# Altium project Mealy.PrjPcb
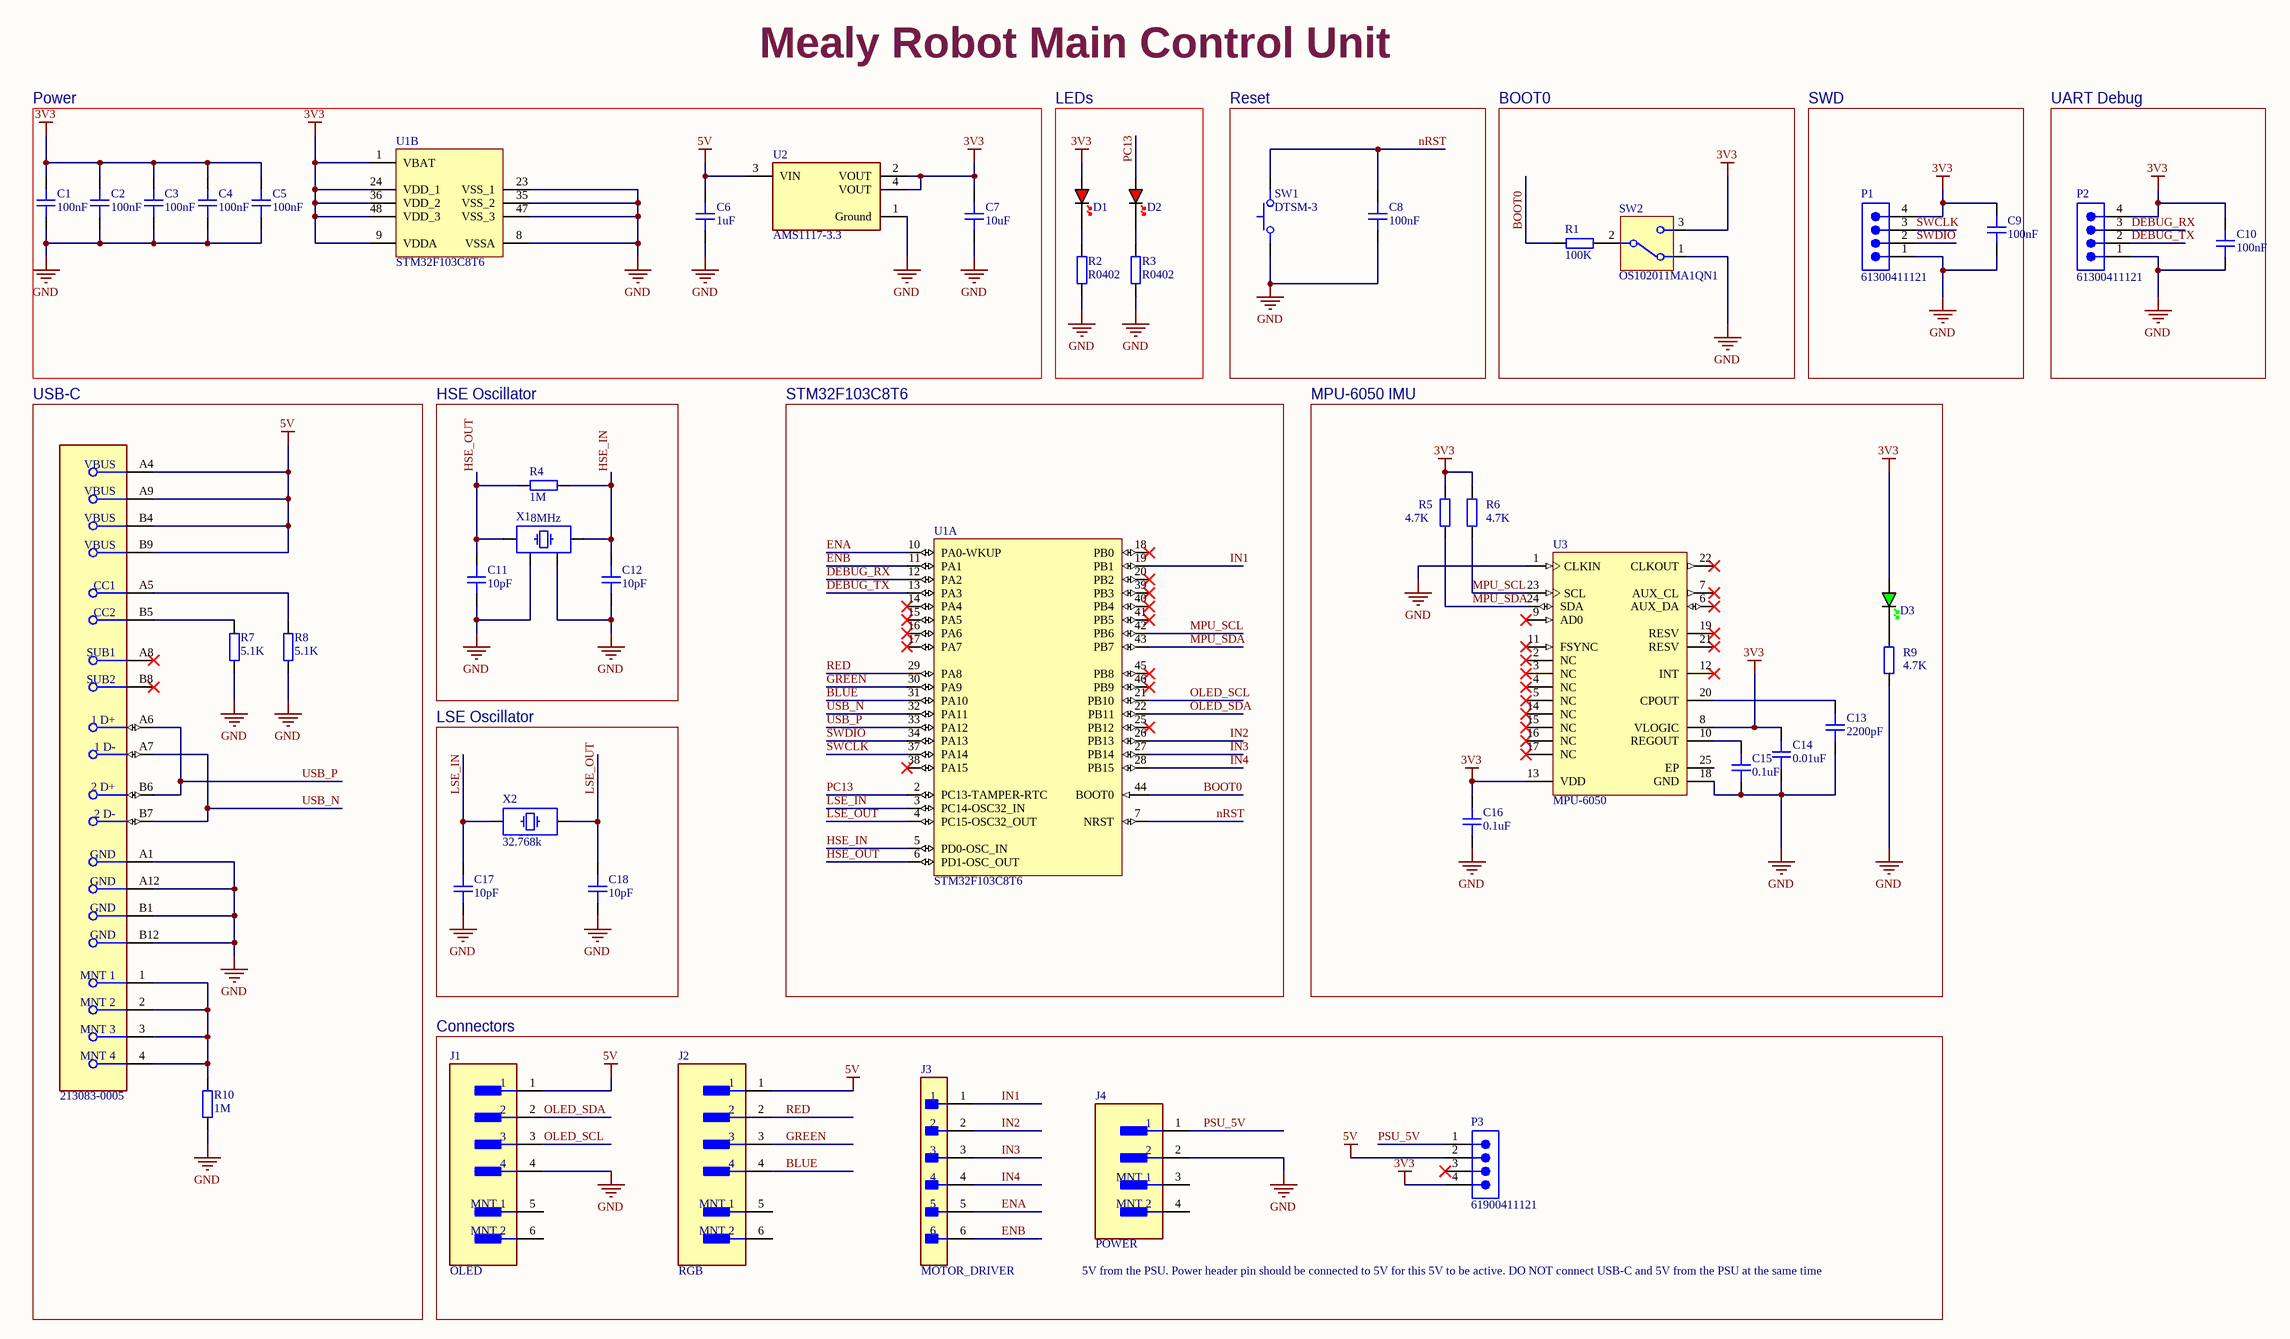
[diagram p0: main.SchDoc]
1 sheet, 46 parts. Net scope: global (net labels, ports and power ports of the same name join across sheets).
Board file: main.PcbDoc

## Sheet main.SchDoc
size C; SheetNumber: 1; SheetTotal: 1

### Parts
C1  100nF  [CAP_0603]
C2  100nF  [CAP_0603]
C3  100nF  [CAP_0603]
C4  100nF  [CAP_0603]
C5  100nF  [CAP_0603]
C6  1uF  [CAP_0603]
C7  10uF  [CAP_0603]
C8  100nF  [CAP_0603]
C9  100nF  [CAP_0603]
C10  100nF  [CAP_0603]
C11  10pF  [CAP_0603]
C12  10pF  [CAP_0603]
C13  2200pF  [CAP_0603]
C14  0.01uF  [CAP_0603]
C15  0.1uF  [CAP_0603]
C16  0.1uF  [CAP_0603]
C17  10pF  [CAP_0603]
C18  10pF  [CAP_0603]
D1  RED  [LED_0603_RED]  (value not drawn)
D2  RED  [LED_0603_RED]  (value not drawn)
D3  GREEN  [LED_0603_GREEN]  (value not drawn)
J1  OLED  [FP-SM04B-ZESS-TB_LF_SN-MFG]
J2  RGB  [FP-SM04B-ZESS-TB_LF_SN-MFG]
J3  MOTOR_DRIVER  [FP-B6P-VH_LF_SN-MFG]
J4  POWER  [FP-BM02B-PASS-1-TFT_LF_S-MFG]
P1  61300411121  [61300411121]
P2  61300411121  [61300411121]
P3  61900411121  [61900411121]
R1  100K  [RES_0603]
R2  R0402  [RES_0402]
R3  R0402  [RES_0402]
R4  1M  [RES_0402]
R5  4.7K  [RES_0603]
R6  4.7K  [RES_0603]
R7  5.1K  [RES_0603]
R8  5.1K  [RES_0603]
R9  4.7K  [RES_0603]
R10  1M  [RES_0603]
SW1  DTSM-3  [DTSM-3]
SW2  OS102011MA1QN1  [OS102011MA1QN1]
U1  STM32F103C8T6  [STM-LQFP48_L]  (parts A,B of 2)
U2  AMS1117-3.3  [FP-AMS1117-IPC_C]
U3  MPU-6050  [IS-QFN-24_V]
X1  8MHz  [XTAL_2520]
X2  32.768k  [XTAL_3215-2]
  213083-0005  [FP-2130830005-MFG]

### Blocks framed on the sheet
Power: C1-C7 U1 U2
LEDs: D1 D2 R2 R3
Reset: C8 SW1
BOOT0: R1 SW2
SWD: C9 P1
UART Debug: C10 P2
USB-C: R7 R8 R10 
HSE Oscillator: C11 C12 R4 X1
STM32F103C8T6: U1
MPU-6050 IMU: C13-C16 D3 R5 R6 R9 U3
LSE Oscillator: C17 C18 X2
Connectors: J1-J4 P3

### Nets
3V3: C1.2 C2.2 C3.2 C4.2 C5.2 C7.2 C9.2 C10.2 C14.2 C16.2 D1.A D3.A P1.4 P2.4 P3.4 R5.2 R6.2 SW2.3 U1.1(VBAT) U1.9(VDDA) U1.24(VDD_1) U1.36(VDD_2) U1.48(VDD_3) U2.2(VOUT) U2.4(VOUT) U3.8(VLOGIC) U3.13(VDD)
5V: C6.2 J1.1 J2.1 P3.2 U2.3(VIN) .A4(VBUS) .A9(VBUS) .B4(VBUS) .B9(VBUS)
GND: C1.1 C2.1 C3.1 C4.1 C5.1 C6.1 C7.1 C8.1 C9.1 C10.1 C11.1 C12.1 C13.1 C14.1 C15.1 C16.1 C17.1 C18.1 J1.4 J4.2 P1.1 P2.1 R2.1 R3.1 R7.1 R8.1 R9.1 R10.1 SW1.1 SW2.1 U1.8(VSSA) U1.23(VSS_1) U1.35(VSS_2) U1.47(VSS_3) U2.1(Ground) U3.1(CLKIN) U3.18(GND) X1.2 X1.4 .A1(GND) .A12(GND) .B1(GND) .B12(GND)
BLUE: J2.4 U1.31(PA10)
BOOT0: R1.1 U1.44(BOOT0)
DEBUG_RX: P2.3 U1.12(PA2)
DEBUG_TX: P2.2 U1.13(PA3)
ENA: J3.5 U1.10(PA0-WKUP)
ENB: J3.6 U1.11(PA1)
GREEN: J2.3 U1.30(PA9)
HSE_IN: C12.2 R4.1 U1.5(PD0-OSC_IN) X1.3
HSE_OUT: C11.2 R4.2 U1.6(PD1-OSC_OUT) X1.1
IN1: J3.1 U1.19(PB1)
IN2: J3.2 U1.26(PB13)
IN3: J3.3 U1.27(PB14)
IN4: J3.4 U1.28(PB15)
LSE_IN: C17.2 U1.3(PC14-OSC32_IN) X2.1
LSE_OUT: C18.2 U1.4(PC15-OSC32_OUT) X2.2
MPU_SCL: R6.1 U1.42(PB6) U3.23(SCL)
MPU_SDA: R5.1 U1.43(PB7) U3.24(SDA)
nRST: C8.2 SW1.2 U1.7(NRST)
OLED_SCL: J1.3 U1.21(PB10)
OLED_SDA: J1.2 U1.22(PB11)
PC13: D2.A U1.2(PC13-TAMPER-RTC)
PSU_5V: J4.1 P3.1
RED: J2.2 U1.29(PA8)
SWCLK: P1.3 U1.37(PA14)
SWDIO: P1.2 U1.34(PA13)
USB_N: U1.32(PA11) .A7(1_D-) .B7(2_D-)
USB_P: U1.33(PA12) .A6(1_D+) .B6(2_D+)
NetC13_2: C13.2 U3.20(CPOUT)
NetC15_2: C15.2 U3.10(REGOUT)
NetD1_K: D1.K R2.2
NetD2_K: D2.K R3.2
NetD3_K: D3.K R9.2
NetR1_2: R1.2 SW2.2(COM)
NetR7_2: R7.2 .B5(CC2)
NetR8_2: R8.2 .A5(CC1)
NetR10_2: R10.2 .1(MNT_1) .2(MNT_2) .3(MNT_3) .4(MNT_4)

Not connected (* = marked no-connect by the designer): J1 5(MNT_1) 6(MNT_2); J2 5(MNT_1) 6(MNT_2); J4 3(MNT_1) 4(MNT_2); P3 3*; U1 14(PA4)* 15(PA5)* 16(PA6)* 17(PA7)* 18(PB0)* 20(PB2)* 25(PB12)* 38(PA15)* 39(PB3)* 40(PB4)* 41(PB5)* 45(PB8)* 46(PB9)*; U3 2(NC)* 3(NC)* 4(NC)* 5(NC)* 6(AUX_DA)* 7(AUX_CL)* 9(AD0)* 11(FSYNC)* 12(INT)* 14(NC)* 15(NC)* 16(NC)* 17(NC)* 19(RESV)* 21(RESV)* 22(CLKOUT)* 25(EP);  A8(SUB1)* B8(SUB2)*

### Notes on the sheet
- Mealy Robot Main Control Unit
- 5V from the PSU. Power header pin should be connected to 5V for this 5V to be active. DO NOT connect USB-C and 5V from the PSU at the same time

### Library data of the parts
C1-C18 = CAP_0603: Capacitor SMD 0603; Manufacturer: *; Manufacturer Part Number: *; Distributor Link: *; LCSC: *; Rating: *; Dielectric: *
D1 D2 = LED_0603_RED: LED 0603 RED SMD
D3 = LED_0603_GREEN: LED 0603 GREEN SMD
J1 J2 = CMP-17439-000309-1: CONN HEADER SMD R/A 4POS 1.5MM; Voltage Rating: 100V; Pitch: 0.059inch; Number of Contacts: 4; Gender: Male; Flammability Rating: UL94 V-0; Contact Finish - Mating: TIN; Insulation Material: Nylon; Series: ZE; Fastening Type: Ramp; Lead Free: Lead Free; Contact Shape: Rectangular; Number of Rows: 1; Packaging: Cut Tape; Mount: Surface Mount; Insulation Color: Natural; Color: Natural; REACH SVHC: No SVHC; Contact Type: Outer Shroud Contact; Number of Positions: 4; Contact Material: Copper Alloy; Max Operating Temperature: 85°C; Min Operating Temperature: -25°C; Contact Plating: Tin; Connector Type: Header; Termination: Solder
J3 = CMP-17439-000380-1: CONN HEADER VERT 6POS 3.96MM; Max Current Rating: 10A; Number of Contacts: 6; Mated Stacking Heights: 16.5mm; Contact Resistance: 20mR; Max Voltage Rating (AC): 250V; Gender: Male; Contact Type: Male Pin; Packaging: Bulk; Insulation Color: Natural; Length: 23.7mm; Orientation: Straight; Color: Natural; Contact Shape: Square; Housing Material: Polyamide; Mount: Through Hole; Max Operating Temperature: 85°C; Pitch: 3.96mm; Number of Positions: 6; Termination: Solder; Height: 8.5mm; Number of Pins: 6; Contact Material: Brass; Current Rating: 10A; Fastening Type: Ramp; Contact Finish - Mating: TIN; Series: VH; Width: 14.6mm; Voltage Rating: 250V; Insulation Material: Nylon; Depth: 8.5mm; Number of Rows: 1; Min Operating Temperature: -25°C; Contact Mating Length: 0.303inch; Lead Free: Lead Free; Flammability Rating: UL94 V-0; Contact Plating: Copper; Housing Color: White; REACH SVHC: No SVHC; Connector Type: Header
J4 = CMP-17439-000073-1: CONN HEADER SMD 2POS 2MM; Number of Positions: 2; Gender: Male; Pitch: 0.079inch; Connector Type: Male Pin; Contact Plating: Tin; Contact Material: Copper; Color: Natural; Packaging: Tape and Reel; Series: PA; Termination: Solder; Mount: Surface Mount; Fastening Type: Ramp; Number of Rows: 1; Lead Free: Lead Free; Number of Contacts: 2; Contact Type: Male Pin
P1 P2 = CMP-1502-01064-2: NexarPartId: 32855522; Pitch: 2.54mm; Number of Contacts: 4; Contact Resistance: 20mΩ; Gender: Male; Current Rating: 3A; Connector Type: Male Pin; Voltage Rating: 250V; Lead Free: Lead Free; Contact Plating: Gold; Max Operating Temperature: 105°C; Packaging: Bulk; Height: 8.89mm; Orientation: Vertical; Contact Mating Length: 5.9944mm; Contact Material: Copper; Lead Pitch: 2.54mm; Min Operating Temperature: -40°C; Termination: Solder; Color: Black; Number of Rows: 1; REACH SVHC: Unknown; RoHS: Compliant; Mount: Through Hole; Number of Positions: 4; Number of Pins: 4; Operating Supply Voltage: 250V
P3 = CMP-1502-00586-2: NexarPartId: 18818226; Connector Type: Male Pin; Insulation: Insulated; Number of Positions: 4; Gender: Male; Operating Supply Voltage: 250V; Pitch: 2.54mm; Current Rating: 3A; Insulation Resistance: 1GΩ; Contact Resistance: 20mΩ; Termination: Through Hole; Contact Material: Copper; Height: 3.3mm; Width: 10.2mm; RoHS: Compliant; REACH SVHC: Unknown; Max Operating Temperature: 105°C; Contact Plating: Tin; Lead Free: Lead Free; Contact Gender: Male; Lead Pitch: 2.54mm; Flammability Rating: UL94 V-0; Packaging: Bulk; Housing Material: Nylon; Number of Pins: 4; Number of Contacts: 4; Color: Beige; Number of Rows: 1; Orientation: Vertical; Contact Mating Length: 7.493mm; Mount: Through Hole; Min Operating Temperature: -40°C; Voltage Rating: 250V; Fastening Type: Friction; Length: 10.16mm
R1 R5-R10 = RES_0603: Resistor SMD 0603; Manufacturer: *; Manufacturer Part Number: *; Distributor Link: *; LCSC: *
R2-R4 = RES_0402: Resistor SMD 0402; Manufacturer: *; Manufacturer Part Number: *; Distributor Link: *; LCSC: *
SW1 = DTSM-3: Tactile Switch SMD SPST; Manufacturer: Diptronics; Manufacturer Part Number: DTSM-3
SW2 = OS102011MA1QN1: Slide Switch SPDT Horizontal THT; Manufacturer: C&K; Manufacturer Part Number: OS102011MA1QN1
U1 = CMP-0237-00215-3: ARM Cortex-M3 32-bit MCU, 64 KB Flash, 20 KB Internal RAM, 37 I/Os, 48-pin LQFP, -40 to 85 degC, Tray; Supply Voltage(Vcc) min (V): 2; Internal RAM Size (kB): 20; FLASH Size (Prog) (kB): 64; A/D Converter: 2x12-bit (10 Channel); I/Os (High Current): 37; Operating Frequency(F) (Processor speed) (MHz): 72; Core: ARM Cortex-M3; ComponentLink3Description: Package Specification; Mounting Technology: Surface Mount; PartNumber: STM32F103C8T6; PackageReference: LQFP48; Packing: Tray; ComponentLink3URL: http://www.st.com/st-web-ui/static/active/en/resource/technical/document/datasheet/DM00058181.pdf; DatasheetVersion: Rev. 16; ComponentLink1URL: http://www.st.com/web/en/home.html; PackageVersion: Rev. 6, 06/2013; ComponentLink2URL: http://www.st.com/st-web-ui/static/active/en/resource/technical/document/datasheet/CD00161566.pdf; ComponentLink1Description: Manufacturer URL; ComponentLink2Description: Datasheet; PackageDescription: 48-Pin Low Profile Quad Flat Package, 7 x 7 mm Body, 0.5 mm Pitch
U2 = CMP-209535-000001-1: LDO Voltage Regulators 1A, 3.3V; Manufacturer: Advanced Monolithic Systems; Dropout Voltage: 1.1V; Output Type: Fixed; Nominal Supply Current: 5mA; Max Power Dissipation: 1.2W; Max Supply Voltage: 15V; Number Of Outputs: 1; Standoff Height: 0.64mm; Max Junction Temp: +125°C; Height: 1.8mm; Package: AMS1117; Device Class L2: Power Management ICs; ComponentLink2Description: Datasheet; ComponentLink2URL: http://www.advanced-monolithic.com/pdf/ds1117.pdf; Category: IC; RoHS: TRUE; Automotive: No; Device Class L1: Integrated Circuits (ICs); Output Current: 1A; Device Class L3: Voltage Regulators - Linear; Temperature: -40°C to +125°C; Output Voltage: 3.3V; Manufacturer Part Number: AMS1117-3.3; Temperature Range Low: -40°C; Octopart: https://octopart.com/ams1117-3.3-advanced+monolithic+systems-25899300; Lead Free: Yes; Ipc Land Pattern Name: SOT229P700X180-4; Temperature Range High: +125°C
U3 = CMP-1753-00002-2: 3-Axis Gyroscope, Accelerometer and a Digital Motion Processor(TM) (DMP), 2.375 to 3.46 V, -40 to 85 degC, 24-Pin QFN, RoHS, Tape and Reel; Manufacturer: InvenSense; Featured Product: MPU-60506-Axis,IntegratedI²CSolution; Other Names: 1428-1007-2 / MPU6050; Sensor Type: MotionTracking; Online Catalog: MPU-6000™Series; Unit PriceUSD: Digital; Datasheet Version: Rev. 3.3, 05/2012; Category: Sensors,Transducers; Datasheet URL: http://datasheet.octopart.com/MPU-6050-InvenSense-datasheet-14421344.pdf; Family: Multifunction; Standard Package: 5,000; Manufacturer URL: http://www.invensense.com/; Output Type: Digital; Dynamic Catalog: MPU-6000™Series
X1 = XTAL_2520: Crystal SMD 2520; Distributor Link: *
X2 = XTAL_3215: Crystal SMD 3215; Distributor Link: *
 = CMP-04767-000030-2: CONN RCP USB2.0 TYP C 24P SMD RA; NexarPartId: 114105384; Current Rating: 5A; Number of Contacts: 16; Voltage Rating: 30V; Gender: Receptacle